# EAGLE design power (EAGLE 6.4)
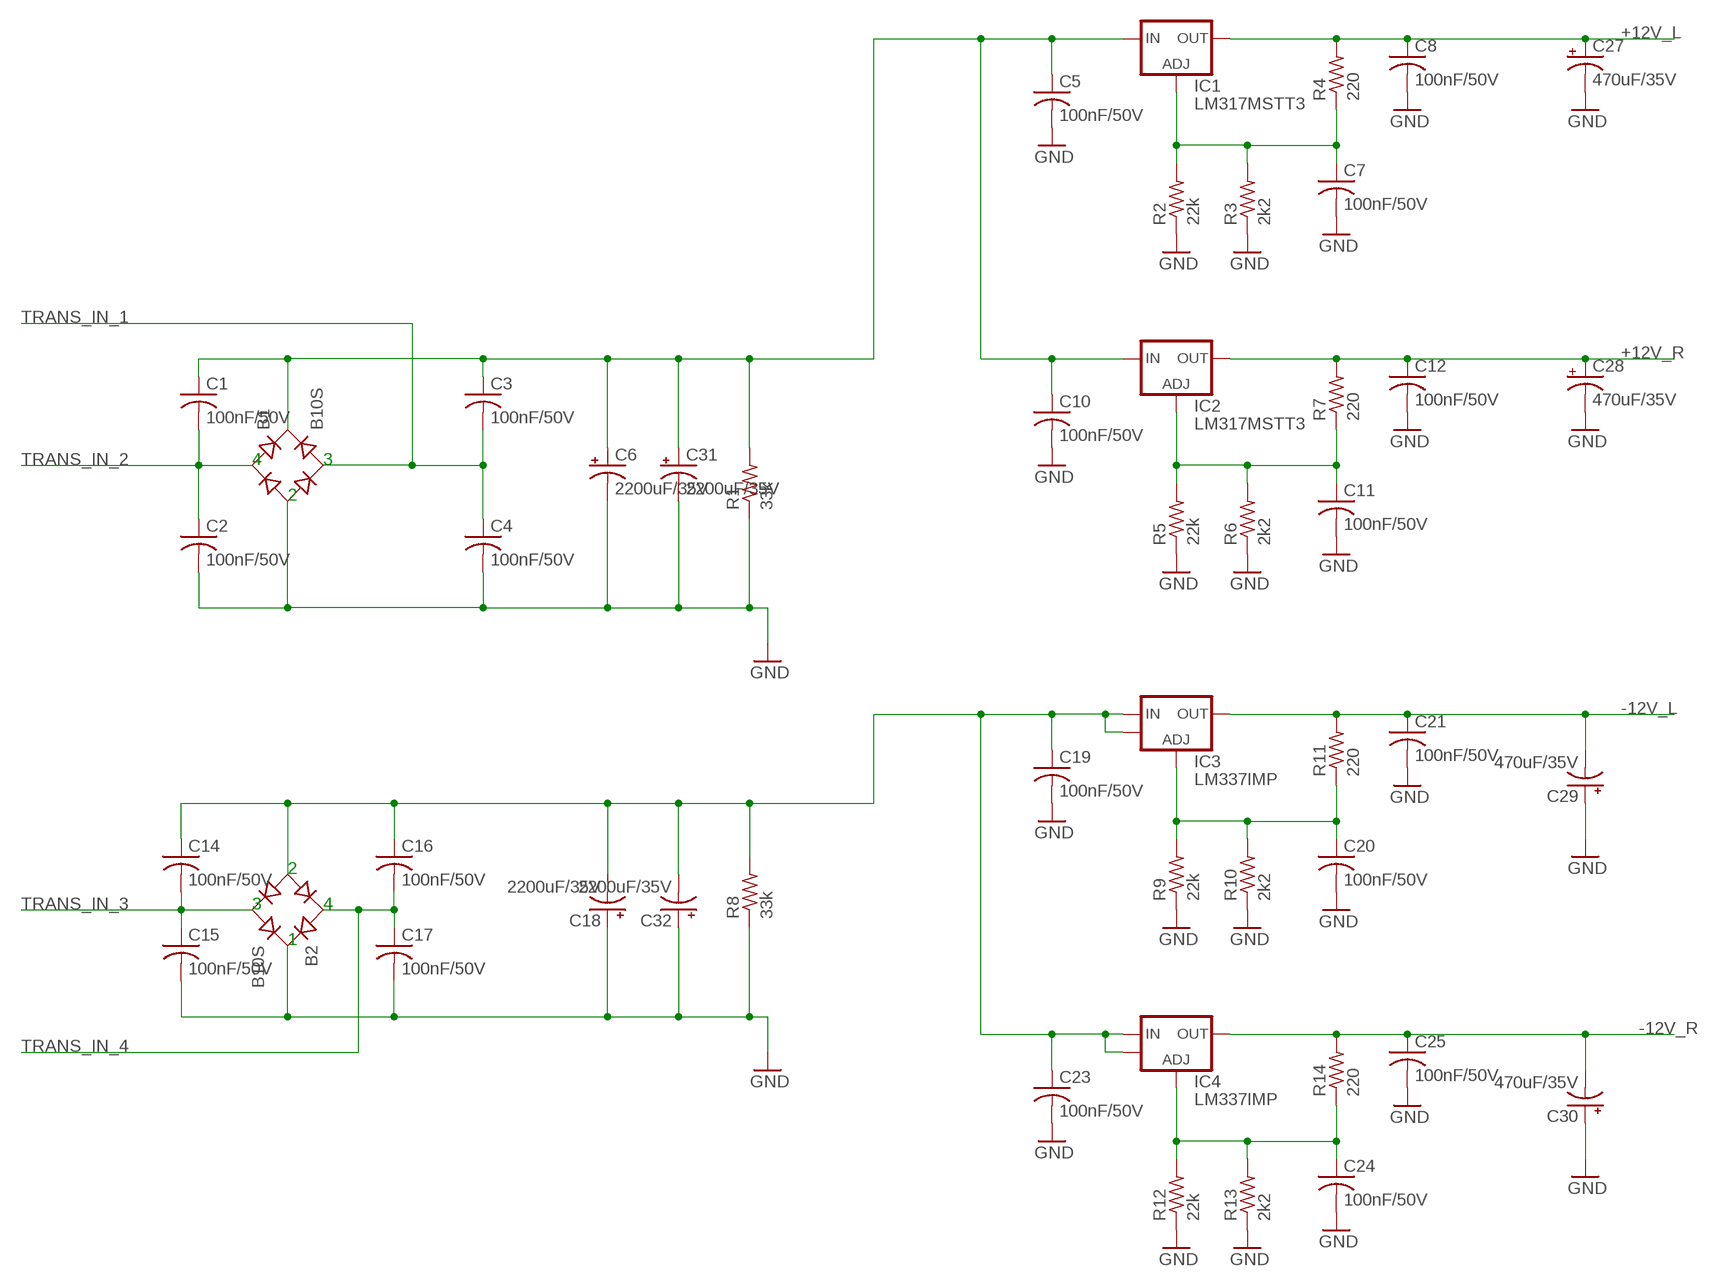
[diagram p0: schematic, sheet 1]

## Parts
B1  B10S  [MBS]
B2  B10S  [MBS]
C1  100nF/50V  C-USC0805  [C0805]
C2  100nF/50V  C-USC0805  [C0805]
C3  100nF/50V  C-USC0805  [C0805]
C4  100nF/50V  C-USC0805  [C0805]
C5  100nF/50V  C-USC0805  [C0805]
C6  2200uF/35V  CPOL-USE5-13  [E5-13]
C7  100nF/50V  C-USC0805  [C0805]
C8  100nF/50V  C-USC0805  [C0805]
C10  100nF/50V  C-USC0805  [C0805]
C11  100nF/50V  C-USC0805  [C0805]
C12  100nF/50V  C-USC0805  [C0805]
C14  100nF/50V  C-USC0805  [C0805]
C15  100nF/50V  C-USC0805  [C0805]
C16  100nF/50V  C-USC0805  [C0805]
C17  100nF/50V  C-USC0805  [C0805]
C18  2200uF/35V  CPOL-USE5-13  [E5-13]
C19  100nF/50V  C-USC0805  [C0805]
C20  100nF/50V  C-USC0805  [C0805]
C21  100nF/50V  C-USC0805  [C0805]
C23  100nF/50V  C-USC0805  [C0805]
C24  100nF/50V  C-USC0805  [C0805]
C25  100nF/50V  C-USC0805  [C0805]
C27  470uF/35V  CPOL-USE5-13  [E5-13]
C28  470uF/35V  CPOL-USE5-13  [E5-13]
C29  470uF/35V  CPOL-USE5-13  [E5-13]
C30  470uF/35V  CPOL-USE5-13  [E5-13]
C31  2200uF/35V  CPOL-USE5-13  [E5-13]
C32  2200uF/35V  CPOL-USE5-13  [E5-13]
IC1  LM317MSTT3  [SOT223]
IC2  LM317MSTT3  [SOT223]
IC3  LM337IMP  [SOT-223]
IC4  LM337IMP  [SOT-223]
R1  33k  R-US_M0805  [M0805]
R2  22k  R-US_M0805  [M0805]
R3  2k2  R-US_M0805  [M0805]
R4  220  R-US_M0805  [M0805]
R5  22k  R-US_M0805  [M0805]
R6  2k2  R-US_M0805  [M0805]
R7  220  R-US_M0805  [M0805]
R8  33k  R-US_M0805  [M0805]
R9  22k  R-US_M0805  [M0805]
R10  2k2  R-US_M0805  [M0805]
R11  220  R-US_M0805  [M0805]
R12  22k  R-US_M0805  [M0805]
R13  2k2  R-US_M0805  [M0805]
R14  220  R-US_M0805  [M0805]

## Nets
+12V_L: C8.1 C27.+ IC1.4(OUT) R4.2
+12V_R: C12.1 C28.+ IC2.4(OUT) R7.2
+VSS_NOREG: B1.+ C1.1 C3.1 C5.1 C6.+ C10.1 C31.+ IC1.3(IN) IC2.3(IN) R1.2
-12V_L: C21.1 C29.- IC3.3(OUT) R11.2
-12V_R: C25.1 C30.- IC4.3(OUT) R14.2
-VSS_NOREG: B2.- C14.1 C16.1 C18.- C19.1 C23.1 C32.- IC3.2(IN) IC3.4 IC4.2(IN) IC4.4 R8.2
GND: B1.- B2.+ C2.2 C4.2 C5.2 C6.- C7.2 C8.2 C10.2 C11.2 C12.2 C15.2 C17.2 C18.+ C19.2 C20.2 C21.2 C23.2 C24.2 C25.2 C27.- C28.- C29.+ C30.+ C31.- C32.+ R1.1 R2.1 R3.1 R5.1 R6.1 R8.1 R9.1 R10.1 R12.1 R13.1
N$7: C7.1 IC1.1(ADJ) R2.2 R3.2 R4.1
N$8: C11.1 IC2.1(ADJ) R5.2 R6.2 R7.1
N$14: C20.1 IC3.1(ADJ) R9.2 R10.2 R11.1
N$17: C24.1 IC4.1(ADJ) R12.2 R13.2 R14.1
TRANS_IN_1: B1.AC2 C3.2 C4.1
TRANS_IN_2: B1.AC1 C1.2 C2.1
TRANS_IN_3: B2.AC2 C14.2 C15.1
TRANS_IN_4: B2.AC1 C16.2 C17.1

## Notes on the sheet
- 4 | 3
- 2
- 2
- 3 | 4
- 1

## Library data of the parts
B1 B2 = rectifier:B*S: Surface Mount Glass Passivated Bridge Rectifiers Source: Comchip Bridge Rectifiers B05S-G_B10S-G.pdf
C1-C5 C7 C8 C10-C12 C14-C17 C19-C21 C23-C25 = rcl:C-US: CAPACITOR, American symbol
C6 C18 C27-C32 = rcl:CPOL-US: POLARIZED CAPACITOR, American symbol
IC1 IC2 = v-reg:LM317?*: 500 mA Adjustable Output Positive Voltage Regulator Source: http://www.onsemi.co.jp .. LM317M-D.PDF
IC3 IC4 = AWJLEagleLib:LM337: LM337 adjustable negative voltage regulator
R1-R14 = rcl:R-US_: RESISTOR, American symbol

## Board
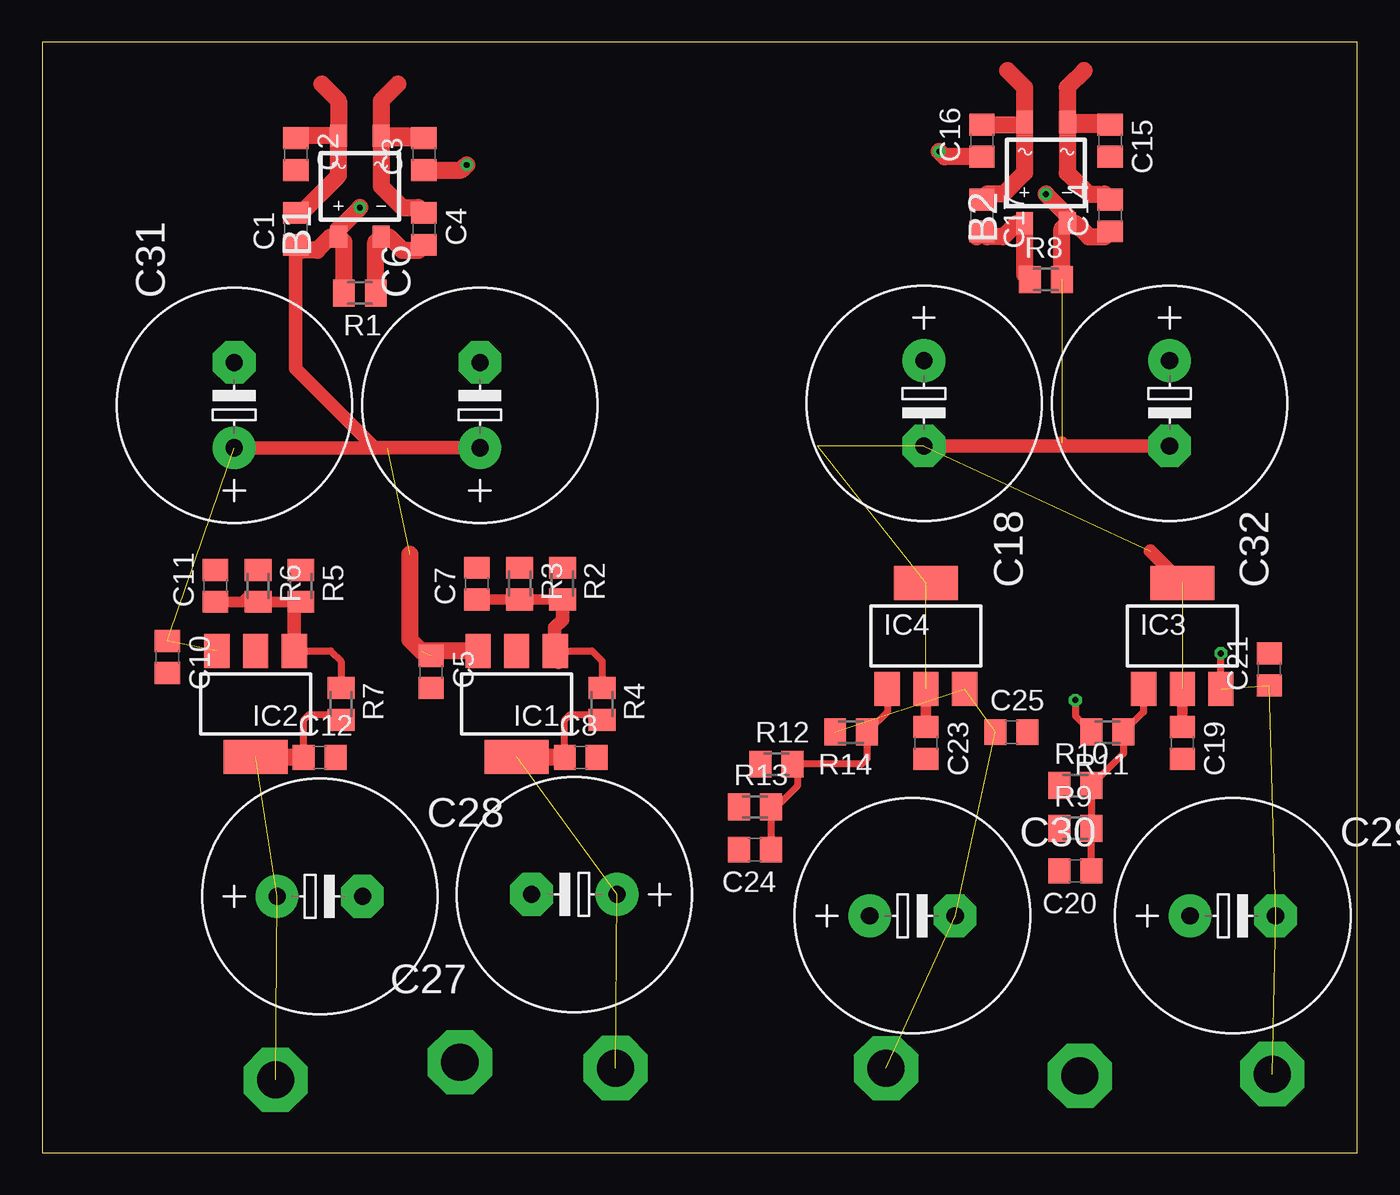
[diagram p1: board, top side]
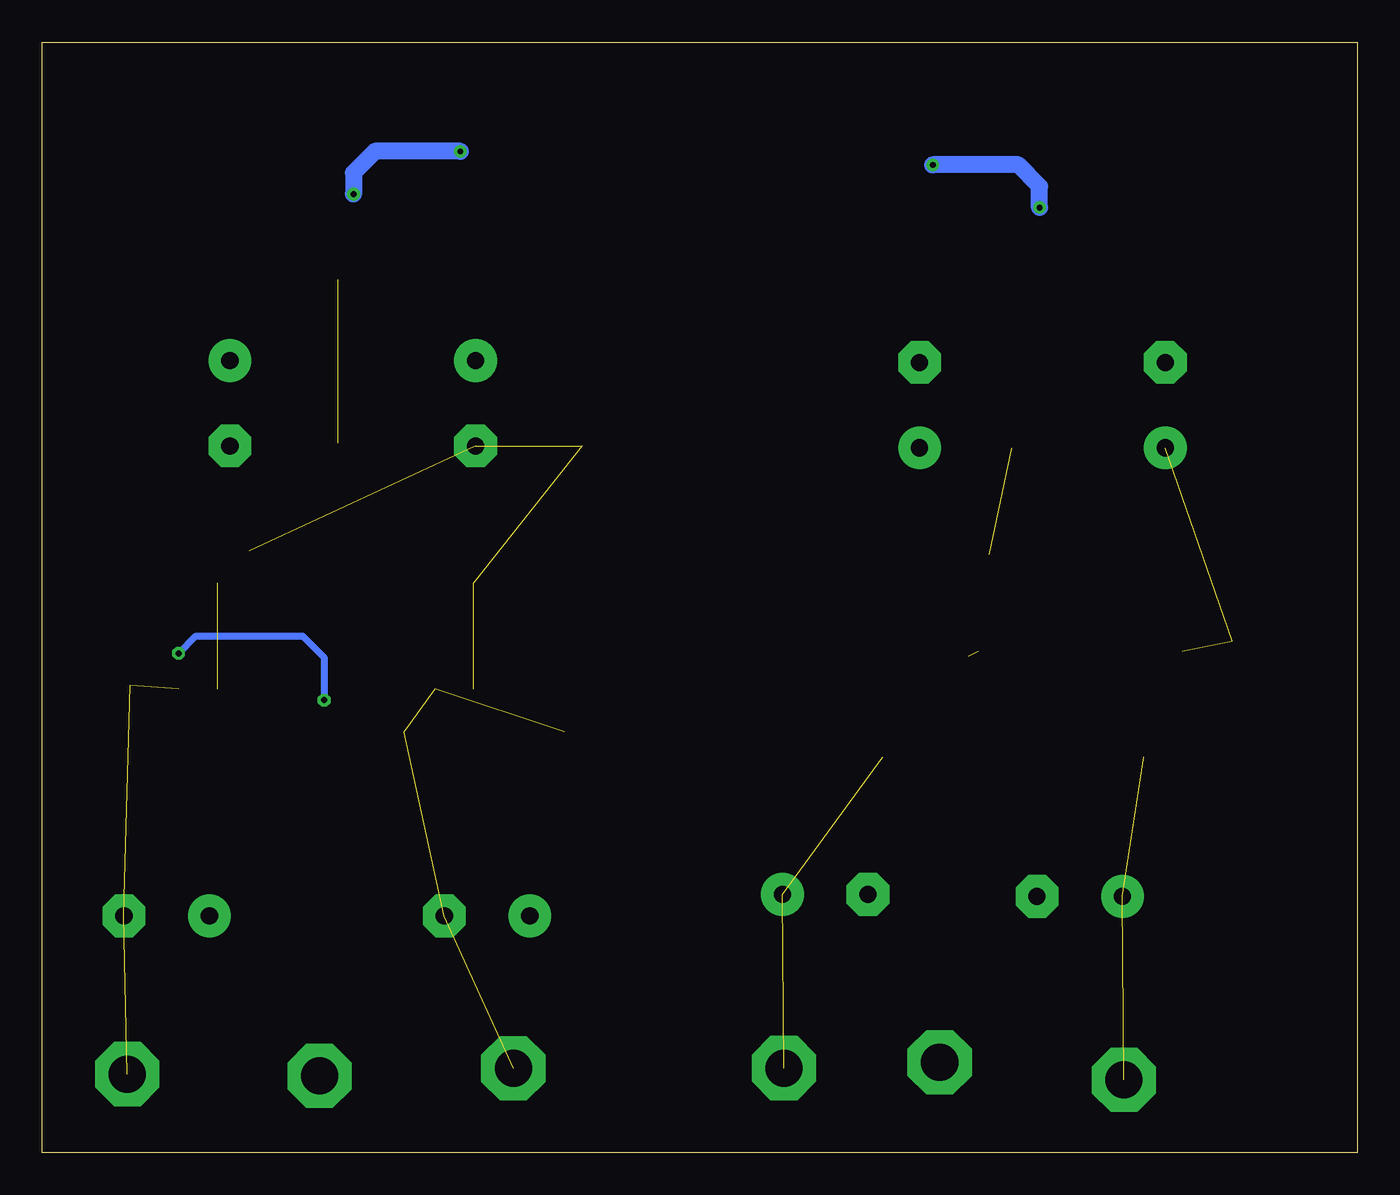
[diagram p2: board, bottom side, seen from below]

Size 78.21 x 66.04 mm. Coordinates in mm from the lower left corner, seen from the top.
Outline: 0,0 78.21,0 78.21,66.04 0,66.04 0,0
Copper layers (1*16): Top 0.035mm / dielectric 1.5mm / Bottom 0.035mm
Design rules "default *": minimum track width 10mil, minimum drill 13mil, track to track 8mil, track to pad 8mil, pad to pad 8mil, via to via 8mil, smd to smd 8mil, copper to edge 40mil, drill to drill 8mil, minimum pad ring 10mil, minimum via ring 8mil, stop-mask expansion 4mil, vias tented up to drill 14mil, thermal gap 10mil

### Footprints (pad centres in the part's own frame; a part is rotated, then mirrored left to right if it is on the bottom)
MBS = smd 1 x 1.3: + -1.27,-3; - 1.27,-3; AC1 -1.27,3; AC2 1.27,3
C0805 = smd 1.3 x 1.5: 1 -0.95,0; 2 0.95,0
E5-13 = drill 1.016 pad 2.54: + -2.54,0 | drill 1.016 pad 2.54 octagon: - 2.54,0
SOT223 = smd 1.5 x 2: 1 -2.3,-3.15; 2 0,-3.15; 3 2.3,-3.15 | smd 3.8 x 2: 4 0,3.15
SOT-223 = smd 1.5 x 2: 1 -2.3,-3.15; 2 0,-3.15; 3 2.3,-3.15 | smd 3.8 x 2: 4 0,3.15
M0805 = smd 1.3 x 1.6: 1 -0.95,0; 2 0.95,0

### Placement (x,y rotation side)
B1  18.9,57.47 0 top
B2  59.69,58.27 0 top
C1  15.09,54.93 90 top
C2  15.09,59.37 270 top
C3  22.71,59.37 90 top
C4  22.71,54.93 270 top
C5  23.14,28.59 270 top
C6  26.03,44.45 90 top
C7  25.86,33.83 90 top
C8  32.03,23.51 0 top
C10  7.45,29.48 270 top
C11  10.31,33.71 90 top
C12  16.51,23.51 0 top
C14  63.5,55.73 90 top
C15  63.5,60.17 270 top
C16  55.88,60.17 90 top
C17  55.88,55.73 270 top
C18  52.44,44.56 270 top
C19  67.79,24.37 270 top
C20  61.44,16.75 180 top
C21  72.97,28.73 90 top
C23  52.55,24.37 270 top
C24  42.39,18.02 180 top
C25  57.63,25.01 0 top
C27  31.65,15.35 180 top
C28  16.51,15.24 0 top
C29  70.8,14.08 0 top
C30  51.75,14.08 0 top
C31  11.43,44.45 90 top
C32  67.04,44.56 270 top
IC1  28.22,26.68 180 top
IC2  12.7,26.68 180 top
IC3  67.79,30.72 0 top
IC4  52.55,30.72 0 top
R1  18.9,51.12 180 top
R2  30.94,33.83 270 top
R3  28.4,33.83 270 top
R4  33.3,26.68 270 top
R5  15.39,33.71 270 top
R6  12.85,33.71 270 top
R7  17.78,26.68 270 top
R8  59.69,51.92 0 top
R9  61.44,19.29 0 top
R10  61.44,21.83 0 top
R11  63.35,25.01 180 top
R12  43.66,23.1 0 top
R13  42.39,20.56 0 top
R14  48.11,25.01 180 top

### Tracks (layer width: path | path; a pad name or v marks a point on that pad's centre or on a via)
+12V_L  (via drill 2.2 pad 3.81)  (3 unrouted)
  Top 0.406: C8.1 31.08,25.73 31.39,26.05 32.98,26.05 R4.2
  Top 1.016: C8.1 28.24,23.51
  other vias: 34.1,5.03
+12V_R  (via drill 2.2 pad 3.81)  (2 unrouted)
  Top 0.406: C12.1 15.56,25.73 15.88,26.05 17.46,26.05 R7.2
  Top 1.016: IC2.4 15.53,23.53 C12.1
  other vias: 13.88,4.33
+VSS_NOREG  (via drill 0.35)  (4 unrouted)
  Top 0.813: C1.1 15.09,46.62 19.77,41.93 20.59,41.93 | 20.59,41.93 26.01,41.93 C6.+ | C31.+ 20.56,41.91 20.59,41.93
  Top 1.016: B1.+ 17.17,54.47 16.36,53.66 15.41,53.66 C1.1 | C3.1 24.93,58.42 v25.25,58.74 | B1.+ 17.63,54.93 v18.9,56.2 | R1.2 17.95,54.15 B1.+ | IC1.3 22.53,29.83 21.87,30.49 21.87,35.57
  Bottom 1.016: v18.9,56.2 18.9,57.47 20.17,58.74 v25.25,58.74
-12V_L  (via drill 0.35, 2.2 pad 3.81)  (3 unrouted)
  Top 0.406: IC3.3 v70.09,29.69 | R11.2 61.44,25.96 v61.44,26.91
  Bottom 0.406: v70.09,29.69 69.06,30.72 62.71,30.72 61.44,29.45 v61.44,26.91
  other vias: 73.14,4.67
-12V_R  (via drill 2.2 pad 3.81)  (4 unrouted)
  other vias: 50.19,5.02
-VSS_NOREG  (via drill 0.35)  (6 unrouted)
  Top 0.61: C23.1 IC4.2 | C19.1 IC3.2
  Top 0.813: C18.- 60.48,42.02 | 60.48,42.02 C32.- | 65.89,35.78 IC3.4 | 60.64,42.19 60.48,42.02
  Top 1.016: C16.1 53.65,59.22 v53.34,59.54 | v59.69,57 60.96,55.73 B2.- | B2.- 61.42,55.27 62.23,54.46 63.18,54.46 C14.1 | R8.2 60.64,54.95 B2.-
  Bottom 1.016: v53.34,59.54 58.42,59.54 59.69,58.27 v59.69,57
GND  (via drill 2.2 pad 3.81)
  Top 1.016: C4.2 22.39,53.66 21.44,53.66 20.63,54.47 B1.- 19.85,54.15 R1.1 | 55.56,54.46 C17.2 56.2,54.46 57.15,54.46 57.96,55.27 B2.+ 58.42,52.24 R8.1
  other vias: 24.84,5.37 61.71,4.56
N$3  (via drill 3.2 pad 3.81)
  other vias: -24.36,58.31
N$5  (via drill 3.2 pad 3.81)
  other vias: -14.45,58.89
N$6  (via drill 3.2 pad 3.81)
  other vias: -14.45,49.06
N$7
  Top 0.406: IC1.1 32.69,29.83 33.3,29.22 R4.1
  Top 0.61: R2.2 R3.2 C7.1
  Top 0.813: R2.2 30.94,31.67 30.48,31.22 30.48,29.38 30.71,29.15 30.71,29.64 IC1.1
N$8
  Top 0.406: IC2.1 17.17,29.83 17.78,29.22 R7.1 | R6.2 12.53,32.76 12.22,33.07 12.54,33.07 R6.2
  Top 0.61: R5.2 R6.2 | C11.1 11.9,32.76 12.22,33.07
  Top 0.813: IC2.1 15,32.36 R5.2
N$9  (via drill 3.2 pad 3.81)
  other vias: -24.94,48.49
N$14
  Top 0.406: IC3.1 65.49,26.2 R11.1 64.3,23.74 R10.2 R9.2 C20.1
N$17
  Top 0.406: IC4.1 50.25,26.2 R14.1 49.06,23.42 48.74,23.1 R12.2 44.93,22.78 44.93,21.83 43.66,20.56 R13.2 C24.1
TRANS_IN_1
  Top 1.016: 21.17,63.55 20.17,62.55 B1.AC2 22.56,60.47 C3.2 20.48,60.32 20.17,60.01 20.17,57.47 21.44,56.2 22.39,56.2 C4.1
TRANS_IN_2
  Top 1.016: 16.63,63.55 17.63,62.55 B1.AC1 | B1.AC1 15.23,60.47 C2.1 | C1.2 15.4,55.88 17.63,58.1 B1.AC1
TRANS_IN_3
  Top 1.016: 61.96,64.35 60.96,63.35 B2.AC2 63.35,61.27 C15.1 61.27,61.12 60.96,60.81 60.96,58.27 62.23,57 63.18,57 C14.2
TRANS_IN_4
  Top 1.016: 57.42,64.35 58.42,63.35 B2.AC1 58.27,61.12 C16.2 58.1,61.12 58.42,60.81 58.42,58.27 57.15,57 56.2,57 C17.1